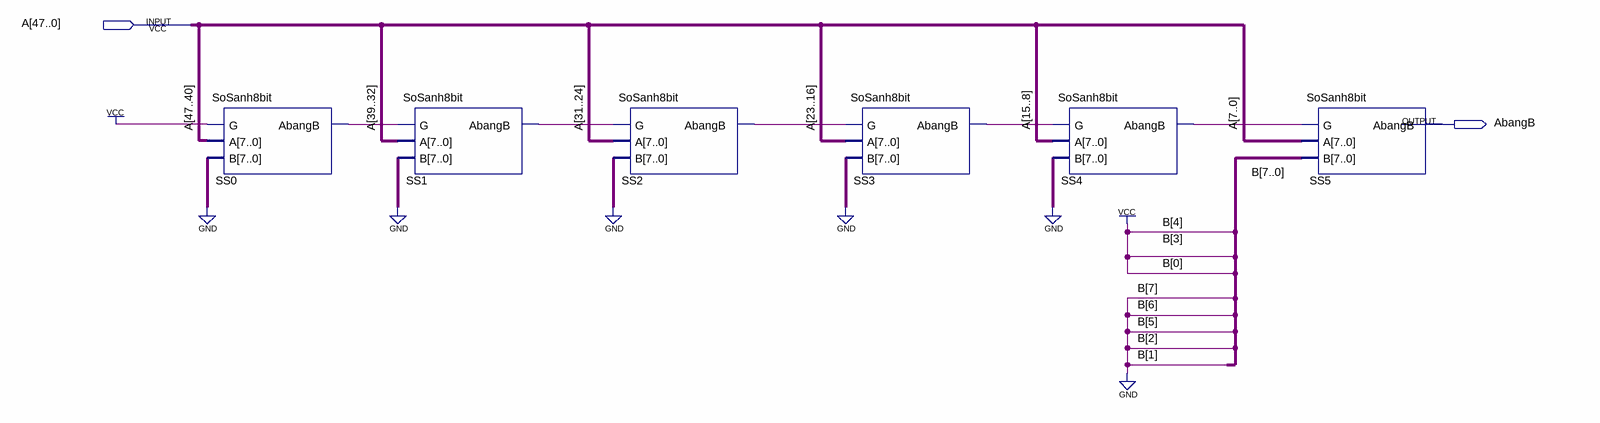
[diagram p0: schematic sheet]
// Quartus schematic SoSanh25.bdf as structural Verilog: 6 symbols, 2 pins
module SoSanh25 (
  input  [47:0] A,
  output AbangB
);

  wire SS0_abangb, SS1_abangb, SS2_abangb, SS3_abangb, SS4_abangb;

  SoSanh8bit SS0 (.G(1'b1), .A(A[47:40]), .B({8{1'b0}}), .AbangB(SS0_abangb));
  SoSanh8bit SS1 (.G(SS0_abangb), .A(A[39:32]), .B({8{1'b0}}), .AbangB(SS1_abangb));
  SoSanh8bit SS2 (.G(SS1_abangb), .A(A[31:24]), .B({8{1'b0}}), .AbangB(SS2_abangb));
  SoSanh8bit SS3 (.G(SS2_abangb), .A(A[23:16]), .B({8{1'b0}}), .AbangB(SS3_abangb));
  SoSanh8bit SS4 (.G(SS3_abangb), .A(A[15:8]), .B({8{1'b0}}), .AbangB(SS4_abangb));
  SoSanh8bit SS5 (.G(SS4_abangb), .A(A[7:0]), .B(8'b00011001), .AbangB(AbangB));
endmodule
